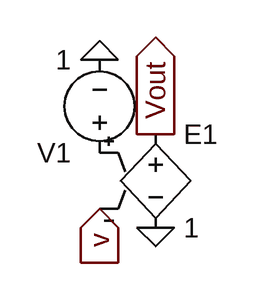
[diagram p0: schematic one_minus_v.asc]
one_minus_v.asc, the LTspice schematic file:
Version 4
SHEET 1 880 680
FLAG 144 176 v
IOPIN 144 176 In
FLAG 144 48 0
FLAG 192 192 0
FLAG 192 112 Vout
IOPIN 192 112 Out
SYMBOL voltage 144 144 R180
WINDOW 123 0 0 Left 0
WINDOW 39 0 0 Left 0
SYMATTR InstName V1
SYMATTR Value 1
SYMBOL e 192 96 R0
SYMATTR InstName E1
SYMATTR Value 1

The netlist it stands for:
* one_minus_v.asc
V1 P001 0 1
E1 Vout 0 P001 v 1
.backanno
.end